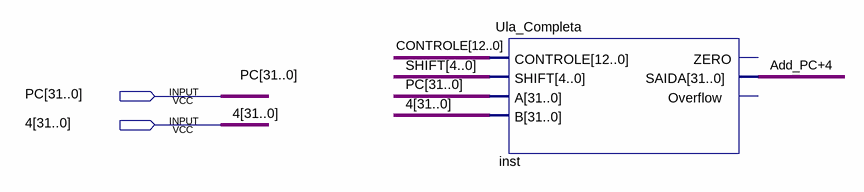
[diagram p0: schematic sheet]
// Quartus schematic Add_Pc+4.bdf as structural Verilog: 1 symbols, 2 pins
module \Add_Pc+4  (
  input  [31:0] PC,
  input  [31:0] \4 
);

  wire \Add_PC+4 ;
  wire [4:0] SHIFT;
  wire [12:0] CONTROLE;

  Ula_Completa inst (.CONTROLE(CONTROLE), .SHIFT(SHIFT), .A(PC), .B(\4 ), .SAIDA(\Add_PC+4 ));  // open: ZERO, Overflow
endmodule
